# EAGLE design GBCZ (EAGLE 8.6.3)

## Sheet 1 of 2: Button PCB and Audio
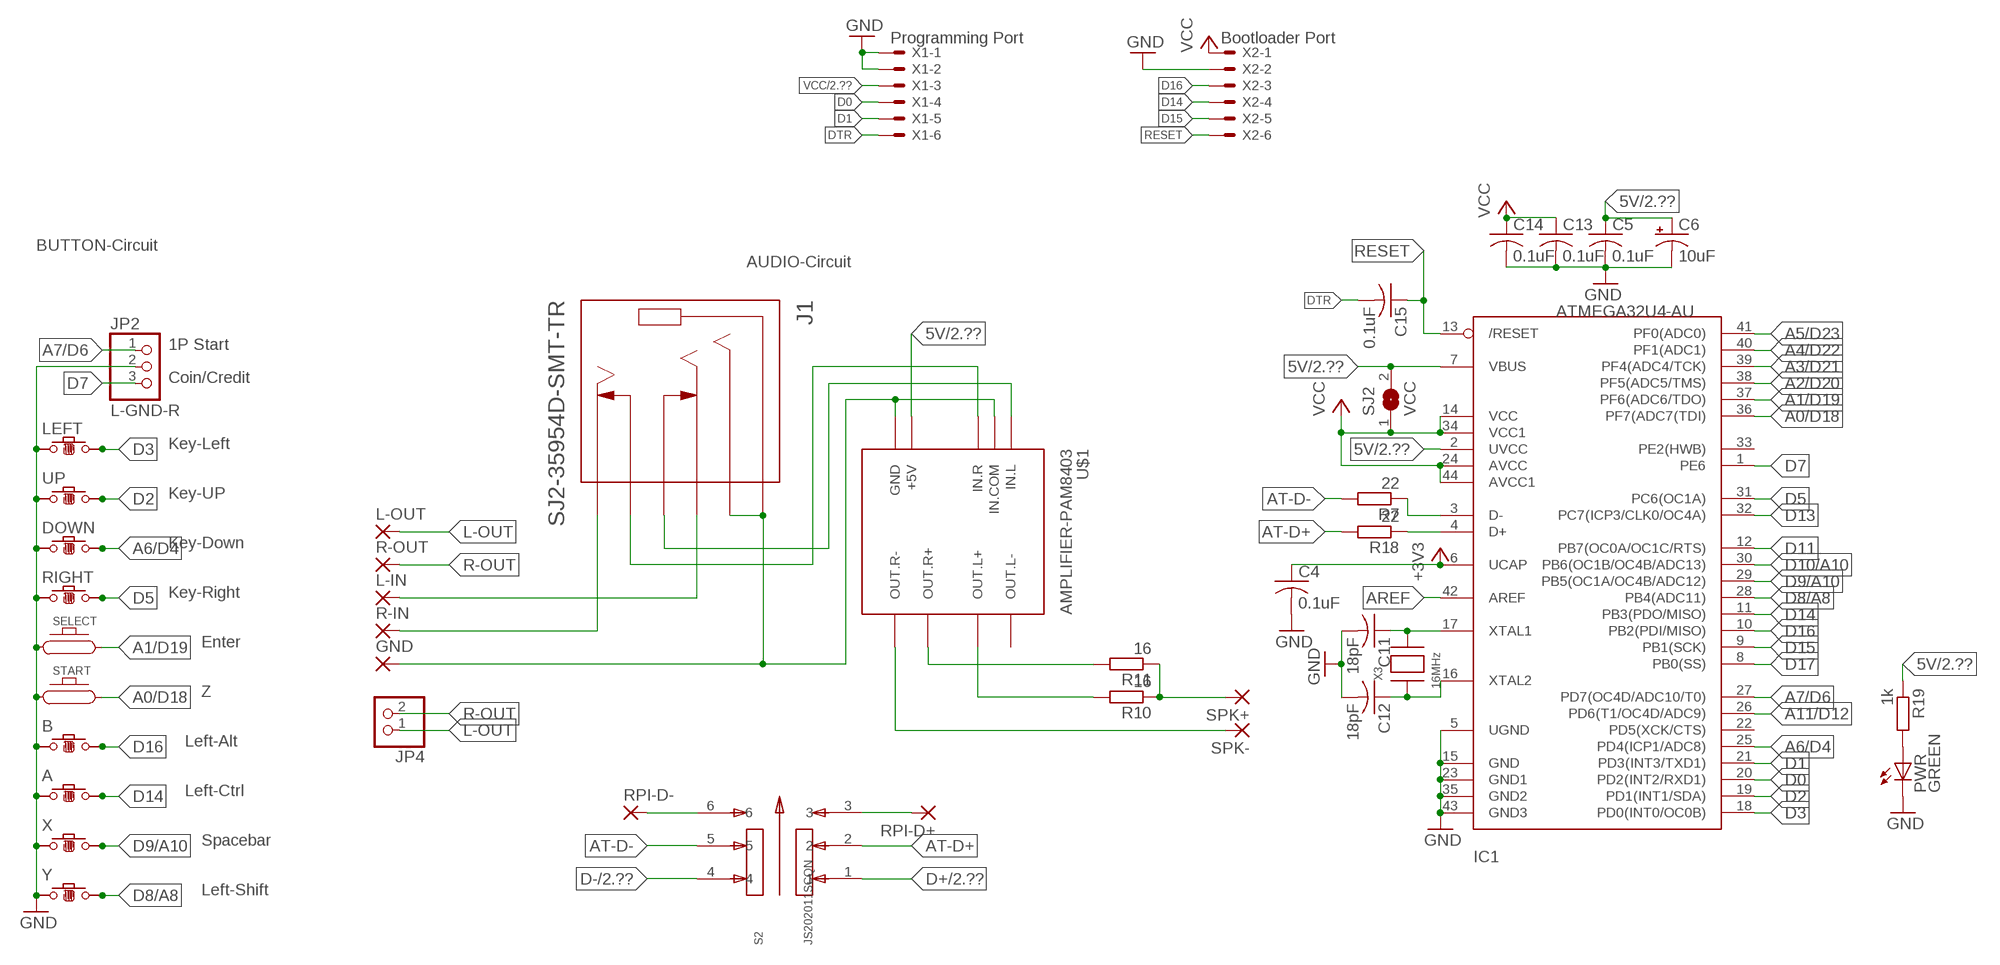
[diagram p0: schematic, sheet 1]

### Parts
A  GBC_BTN  [GBC_BTN]
B  GBC_BTN  [GBC_BTN]
C4  0.1uF  C-USC0805K  [C0805K]
C5  0.1uF  C-USC0805K  [C0805K]
C6  10uF  CPOL-USA/3216-18R  [A/3216-18R]
C11  18pF  C-USC0805K  [C0805K]
C12  18pF  C-USC0805K  [C0805K]
C13  0.1uF  C-USC0805K  [C0805K]
C14  0.1uF  C-USC0805K  [C0805K]
C15  0.1uF  C-USC0805K  [C0805K]
DOWN  GBC_BTN  [GBC_BTN]
GND  WIREPADSMD1,27-254  [SMD1,27-2,54]
IC1  ATMEGA32U4-AU  [TQFP44]
J1  SJ2-35954D-SMT-TR  [CUI_SJ2-35954D-SMT-TR]
JP2  L-GND-R  PINHD-1X3  [1X03]
JP4  PINHD-1X2  [1X02]
L-IN  WIREPADSMD1,27-254  [SMD1,27-2,54]
L-OUT  WIREPADSMD1,27-254  [SMD1,27-2,54]
LEFT  GBC_BTN  [GBC_BTN]
PWR  GREEN  LEDCHIPLED_0805  [CHIPLED_0805]
R7  22  R-EU_R0603  [R0603]
R10  16  R-EU_R0603  [R0603]
R11  16  R-EU_R0603  [R0603]
R18  22  R-EU_R0603  [R0603]
R19  1k  R-EU_R0603  [R0603]
R-IN  WIREPADSMD1,27-254  [SMD1,27-2,54]
R-OUT  WIREPADSMD1,27-254  [SMD1,27-2,54]
RIGHT  GBC_BTN  [GBC_BTN]
RPI-D+  WIREPADSMD1,27-254  [SMD1,27-2,54]
RPI-D-  WIREPADSMD1,27-254  [SMD1,27-2,54]
S2  JS202011SCQN  [SW_JS202011SCQN]
SELECT  GBC_BTN_START  [GBC_BTN_START]
SJ2  VCC  SJ  [SJ]
SPK+  WIREPADSMD1,27-254  [SMD1,27-2,54]
SPK-  WIREPADSMD1,27-254  [SMD1,27-2,54]
START  GBC_BTN_START  [GBC_BTN_START]
U$1  AMPLIFIER-PAM8403  [AMPLIFIER-PAM8403]
UP  GBC_BTN  [GBC_BTN]
X  GBC_BTN  [GBC_BTN]
X1  Programming Port  22-23-2061  [22-23-2061]
X2  Bootloader Port  22-23-2061  [22-23-2061]
X3  16MHz  XTALNX5032  [NX5032]
Y  GBC_BTN  [GBC_BTN]

### Nets
5V: C5.1 C6.+ IC1.2(UVCC) IC1.7(VBUS) R19.1 SJ2.2 U$1.+5V ; also sheet 2
+3V3: C4.1 IC1.6(UCAP)
A0/D18: IC1.36(PF7(ADC7(TDI)) START.P$2
A1/D19: IC1.37(PF6(ADC6/TDO)) SELECT.P$2
A2/D20: IC1.38(PF5(ADC5/TMS))
A3/D21: IC1.39(PF4(ADC4/TCK))
A4/D22: IC1.40(PF1(ADC1))
A5/D23: IC1.41(PF0(ADC0))
A6/D4: DOWN.P$2 IC1.25(PD4(ICP1/ADC8))
A7/D6: IC1.27(PD7(OC4D/ADC10/T0)) JP2.1
A11/D12: IC1.26(PD6(T1/OC4D/ADC9))
AREF: IC1.42(AREF)
AT-D+: R18.2 S2.2
AT-D-: R7.2 S2.5
D0: IC1.20(PD2(INT2/RXD1)) X1.4
D1: IC1.21(PD3(INT3/TXD1)) X1.5
D2: IC1.19(PD1(INT1/SDA)) UP.P$2
D3: IC1.18(PD0(INT0/OC0B)) LEFT.P$2
D5: IC1.31(PC6(OC1A)) RIGHT.P$2
D7: IC1.1(PE6) JP2.3
D8/A8: IC1.28(PB4(ADC11)) Y.P$2
D9/A10: IC1.29(PB5(OC1A/OC4B/ADC12)) X.P$2
D10/A10: IC1.30(PB6(OC1B/OC4B/ADC13))
D11: IC1.12(PB7(OC0A/OC1C/RTS))
D13: IC1.32(PC7(ICP3/CLK0/OC4A))
D14: A.P$2 IC1.11(PB3(PDO/MISO)) X2.4
D15: IC1.9(PB1(SCK)) X2.5
D16: B.P$2 IC1.10(PB2(PDI/MISO)) X2.3
D17: IC1.8(PB0(SS))
D+: S2.1 ; also sheet 2
D-: S2.4 ; also sheet 2
DTR: C15.2 X1.6
GND: A.P$1 B.P$1 C4.2 C5.2 C6.- C11.2 C12.2 C13.2 C14.2 DOWN.P$1 IC1.5(UGND) IC1.15(GND) IC1.23(GND1) IC1.35(GND2) IC1.43(GND3) JP2.2 LEFT.P$1 PWR.C RIGHT.P$1 SELECT.P$1 START.P$1 UP.P$1 X1.1 X1.2 X2.2 X.P$1 Y.P$1 ; also sheet 2
L-OUT: JP4.1 L-OUT.1(P)
N$1: RPI-D-.1(P) S2.6
N$2: RPI-D+.1(P) S2.3
N$21: R11.2 U$1.OUT.R+
N$22: GND.1(P) J1.1(SLEEVE) J1.4(RING2) U$1.GND U$1.IN.COM
N$23: J1.11(RING1_SWITCH) U$1.IN.L
N$24: J1.10(TIP_SWITCH) U$1.IN.R
N$25: J1.2(TIP) R-IN.1(P)
N$26: J1.3(RING1) L-IN.1(P)
N$27: R10.2 U$1.OUT.L+
N$28: R10.1 R11.1 SPK+.1(P)
N$29: SPK-.1(P) U$1.OUT.R-
N$41: IC1.3(D-) R7.1
N$42: IC1.4(D+) R18.1
N$43: C12.1 IC1.16(XTAL2) X3.P$1
N$44: C11.1 IC1.17(XTAL1) X3.P$2
N$45: PWR.A R19.2
R-OUT: JP4.2 R-OUT.1(P)
RESET: C15.1 IC1.13(/RESET) X2.6
VCC: C13.1 C14.1 IC1.14(VCC) IC1.24(AVCC) IC1.34(VCC1) IC1.44(AVCC1) SJ2.1 X1.3 ; also sheet 2
Unconnected: IC1.22(PD5(XCK/CTS)) IC1.33(PE2(HWB)) U$1.OUT.L- X2.1

### Notes on the sheet
- BUTTON-Circuit
- AUDIO-Circuit
- 1P Start
- Coin/Credit
- Key-Left
- Key-UP
- Key-Down
- Key-Right
- Enter
- Z
- Left-Alt
- Left-Ctrl
- Spacebar
- Left-Shift

## Sheet 2 of 2: Batterie Charging/Boosting/Protection
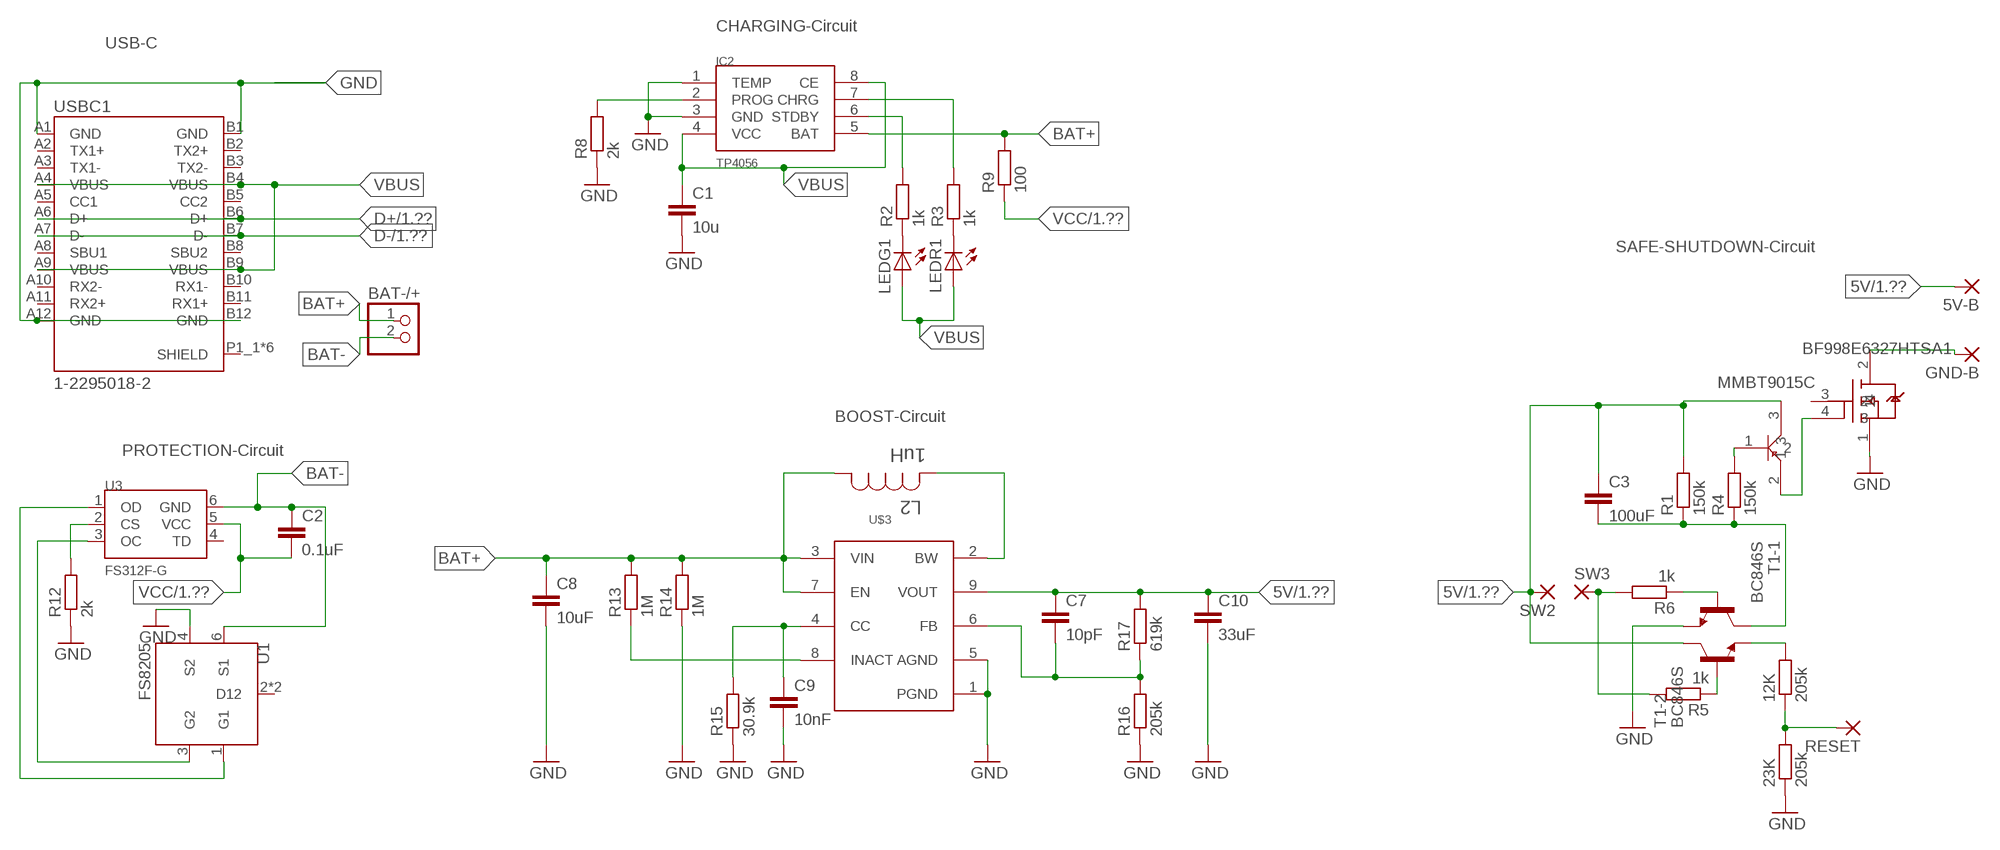
[diagram p1: schematic, sheet 2]

### Parts
5V-B  WIREPADSMD1,27-254  [SMD1,27-2,54]
12K  205k  R-EU_R0603  [R0603]
23K  205k  R-EU_R0603  [R0603]
BAT-/+  PINHD-1X2  [1X02]
BF998E6327HTSA1  INF-SOT143-4-1_V_1  [INF-SOT143-4-1_V_1PRIMARY]
C1  10u  C-EUC0603  [C0603]
C2  0.1uF  C-EUC0603  [C0603]
C3  100uF  C-EUC1812  [C1812]
C7  10pF  C-EUC1812  [C1812]
C8  10uF  C-EUC1812  [C1812]
C9  10nF  C-EUC1812  [C1812]
C10  33uF  C-EUC1812  [C1812]
GND-B  WIREPADSMD1,27-254  [SMD1,27-2,54]
IC2  TP4056  [SOP-8]
L2  1uH  DR74-220-R  [INDM7676X435N]
LEDG1  LEDCHIP-LED0603  [CHIP-LED0603]
LEDR1  LEDCHIP-LED0603  [CHIP-LED0603]
MMBT9015C  INF-SOT23_M_1  [INF-SOT23_M_1PRIMARY]
R1  150k  R-EU_R0603  [R0603]
R2  1k  R-EU_R0603  [R0603]
R3  1k  R-EU_R0603  [R0603]
R4  150k  R-EU_R0603  [R0603]
R5  1k  R-EU_R0603  [R0603]
R6  1k  R-EU_R0603  [R0603]
R8  2k  R-EU_R0603  [R0603]
R9  100  R-EU_R0603  [R0603]
R12  2k  R-EU_R0603  [R0603]
R13  1M  R-EU_R0603  [R0603]
R14  1M  R-EU_R0603  [R0603]
R15  30.9k  R-EU_R0603  [R0603]
R16  205k  R-EU_R0603  [R0603]
R17  619k  R-EU_R0603  [R0603]
RESET  WIREPADSMD1,27-254  [SMD1,27-2,54]
SW2  WIREPADSMD1,27-254  [SMD1,27-2,54]
SW3  WIREPADSMD1,27-254  [SMD1,27-2,54]
T1  BC846S  [SOT363]
U1  FS8205  [SOT23-6]
U3  FS312F-G  [SOT23-6]
U$3  TPS61235RWLR  CONV_TPS61235RWLR  [CONV_TPS61235RWLR]
USBC1  1-2295018-2  [TE_1-2295018-2]

### Nets
5V: 5V-B.1(P) C3.1 C7.1 C10.1 MMBT9015C.3 R1.2 R17.2 SW2.1(P) T1.3(-2:C) U$3.9(VOUT) ; also sheet 1
BAT+: BAT-/+.1 C8.1 IC2.5(BAT) L2.1 R9.2 R13.2 R14.2 U$3.3(VIN) U$3.7(EN)
BAT-: BAT-/+.2 C2.1 U1.6(S1) U3.6(GND)
D+: USBC1.A6(D+) USBC1.B6(D+) ; also sheet 1
D-: USBC1.A7(D-) USBC1.B7(D-) ; also sheet 1
GND: 23K.1 BF998E6327HTSA1.1 C1.2 C8.2 C9.2 C10.2 IC2.1(TEMP) IC2.3(GND) R8.1 R12.1 R14.1 R15.1 R16.1 T1.1(-1:E) U1.4(S2) U$3.1(PGND) U$3.5(AGND) USBC1.A1(GND) USBC1.A12(GND) USBC1.B1(GND) USBC1.B12(GND) ; also sheet 1
N$11: BF998E6327HTSA1.2 GND-B.1(P)
N$12: BF998E6327HTSA1.4 MMBT9015C.2
N$13: MMBT9015C.1 R4.2
N$14: 12K.2 T1.4(-2:E)
N$15: C3.2 R1.1 R4.1 T1.6(-1:C)
N$16: R6.1 T1.2(-1:B)
N$17: R5.2 R6.2 SW3.1(P)
N$18: R5.1 T1.5(-2:B)
N$19: R13.1 U$3.8(INACT)
N$20: C9.1 R15.2 U$3.4(CC)
N$30: IC2.6(STDBY) R2.2
N$31: IC2.7(CHRG) R3.2
N$32: LEDG1.C R2.1
N$33: L2.2 U$3.2(BW)
N$34: LEDR1.C R3.1
N$35: C7.2 R16.2 R17.1 U$3.6(FB)
N$36: IC2.2(PROG) R8.2
N$37: U1.3(G2) U3.3(OC)
N$38: U1.1(G1) U3.1(OD)
N$39: R12.2 U3.2(CS)
N$40: 12K.1 23K.2 RESET.1(P)
VBUS: C1.1 IC2.4(VCC) IC2.8(CE) LEDG1.A LEDR1.A USBC1.A4(VBUS) USBC1.A9(VBUS) USBC1.B4(VBUS) USBC1.B9(VBUS)
VCC: C2.2 R9.1 U3.5(VCC) ; also sheet 1
Unconnected: BF998E6327HTSA1.3 U1.2(D12) U1.5(D12) U3.4(TD) USBC1.A2(TX1+) USBC1.A3(TX1-) USBC1.A5(CC1) USBC1.A8(SBU1) USBC1.A10(RX2-) USBC1.A11(RX2+) USBC1.B2(TX2+) USBC1.B3(TX2-) USBC1.B5(CC2) USBC1.B8(SBU2) USBC1.B10(RX1-) USBC1.B11(RX1+) USBC1.P1_1(SHIELD) USBC1.P1_2(SHIELD) USBC1.P2_1(SHIELD) USBC1.P2_2(SHIELD) USBC1.P4(SHIELD) USBC1.P5(SHIELD)

### Notes on the sheet
- CHARGING-Circuit
- USB-C
- SAFE-SHUTDOWN-Circuit
- BOOST-Circuit
- PROTECTION-Circuit

## Library data of the parts
5V-B GND GND-B L-IN L-OUT R-IN R-OUT RESET RPI-D+ RPI-D- SPK+ SPK- SW2 SW3 = wirepad:WIREPAD: Wire PAD connect wire on PCB
12K 23K R1-R19 = rcl:R-EU_: RESISTOR, European symbol; SPICEPREFIX: R
A B DOWN LEFT RIGHT UP X Y = GB Color:GBC_BTN
BAT-/+ JP4 = pinhead:PINHD-1X2: PIN HEADER
BF998E6327HTSA1 = INF-SOT143-4-1_V:INF-SOT143-4-1_V_1
C1-C3 C7-C10 = rcl:C-EU: CAPACITOR, European symbol; SPICEPREFIX: C
C4 C5 C11-C15 = adafruit:C-US: CAPACITOR, American symbol
C6 = adafruit:CPOL-US: POLARIZED CAPACITOR, American symbol
IC1 = adaprog:ATMEGA32U4
IC2 = TP4056:TP4056
J1 = SJ2-35954D-SMT-TR:SJ2-35954D-SMT-TR: 4 conductors, 3.5mm, SMT Audio Jack w/ 2 Switch; AVAILABILITY: Good; DESCRIPTION: 4 conductors, 3.5mm, SMT Audio Jack w/ 2 Switch; MF: CUI; MP: SJ2-35954D-SMT-TR; PACKAGE: None; PRICE: 0.94 USD
JP2 = pinhead:PINHD-1X3: PIN HEADER
L2 = DR74-220-R:DR74-220-R: POWER INDUCTOR; AVAILABILITY: Good; DESCRIPTION: Inductor Power Shielded Drum Core 21.73uH/22uH 20% 100KHz Ferrite 1.75A 92.5mOhm DCR T/R; MF: Eaton; MP: DR74-220-R; PACKAGE: Nonstandard Eaton; PRICE: 0.98 USD
LEDG1 LEDR1 = led:LED: LED
MMBT9015C = INF-SOT23_M:INF-SOT23_M_1
PWR = adafruit:LED: LED
S2 = JS202011SCQN:JS202011SCQN: JS Series DPDT On-On Gull Wing Surface Mount Subminiature Slide Switch; AVAILABILITY: Unavailable; DESCRIPTION: JS Series DPDT On-On Gull Wing Surface Mount Subminiature Slide Switch; MF: C&K Components; MP: JS202011SCQN; PACKAGE: None; PRICE: None
SELECT START = GB Color:GBC_BTN_START: START and SELECT button for the Game Boy Color
SJ2 = jumper:SJ: SMD solder JUMPER
T1 = nxp_60:BC846S: Dual 65 V, 100 mA NPN/NPN general-purpose transistor AAL Eindhoven MK
U1 = fs8205:FS8205
U3 = fs321f-g:FS312F-G
U$1 = diy-modules:AMPLIFIER-PAM8403: Stereo Class-D 3W Audio Amplifier based on PAM8403 chip More details available here: http://artofcircuits.com/product/pam8403-5v-two-channel-stereo-mini-class-d-3w3w-audio-amplifier Click here to find device on ebay.com <http://www.ebay.com/sch/pam8403+mini+class+d>
U$3 = CONV_TPS61235RWLR:CONV_TPS61235RWLR
USBC1 = 1-2295018-2:1-2295018-2: SPLASH PROOF USB TYPE C REC, DUAL SMT; Tape/Reel of 900; AVAILABILITY: Good; CENTERLINE_PITCH: .5 mm[.019 in]; COMMENT: 1-2295018-2; DESCRIPTION: USB TYPE C, REC OFFSET 0.65MM DUAL SMT; MF: TE Connectivity; MP: 1-2295018-2; NUMBER_OF_POSITIONS: 24; PACKAGE: None; PRICE: 1.82 USD; PRODUCT_TYPE: Connector
X1 X2 = con-molex:22-23-2061: .100" (2.54mm) Center Header - 6 Pin; MF: MOLEX; MPN: 22-23-2061; OC_FARNELL: 1462922; OC_NEWARK: 27C1933
X3 = adaprog:XTAL

## Board
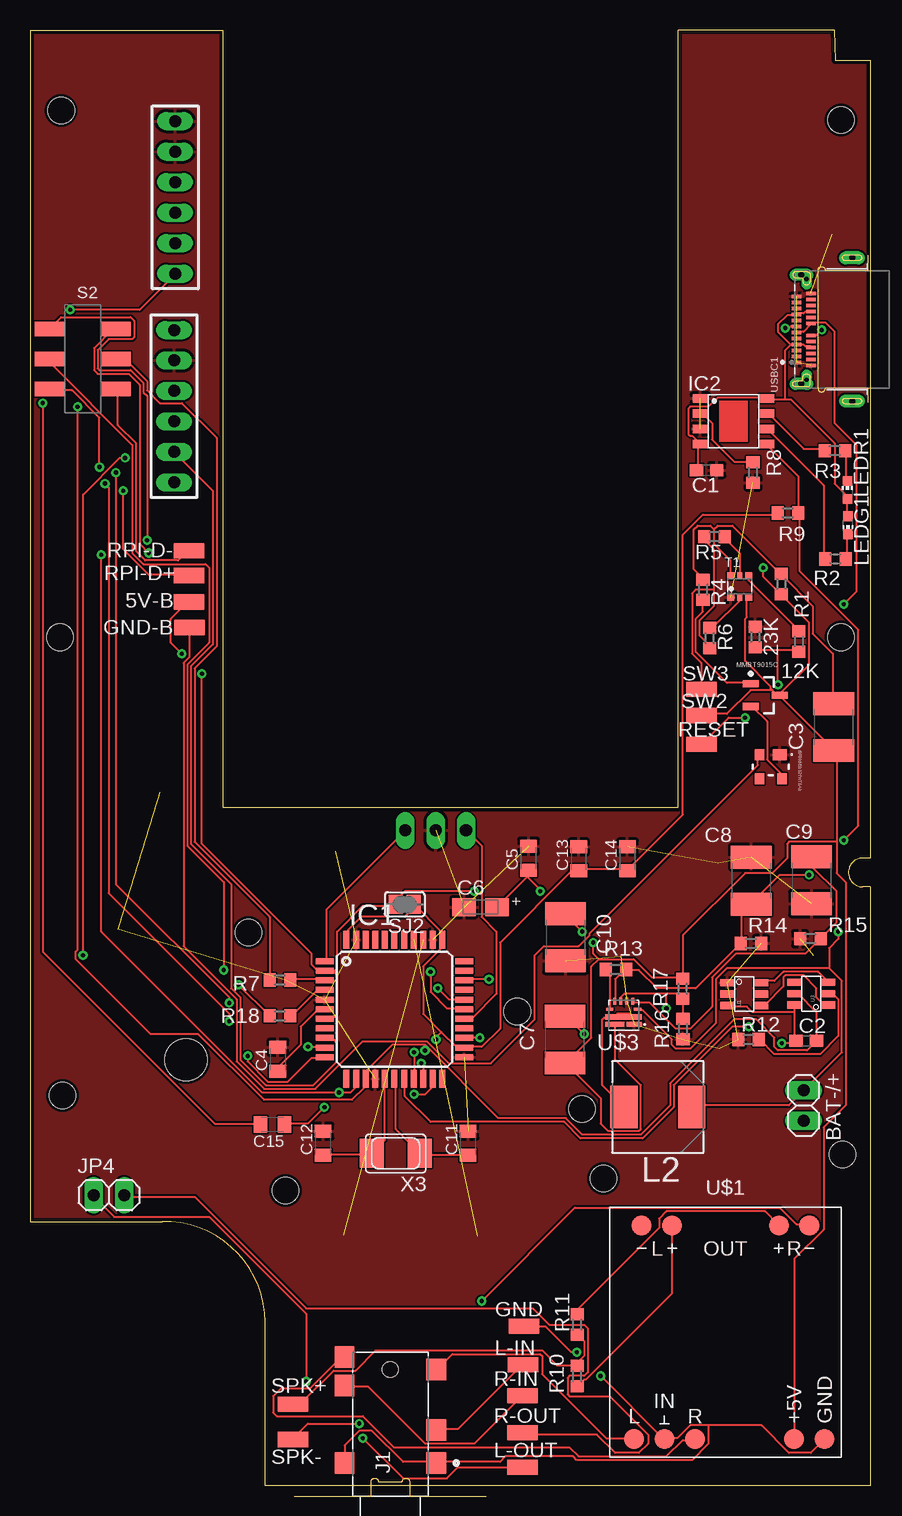
[diagram p2: board, top side]
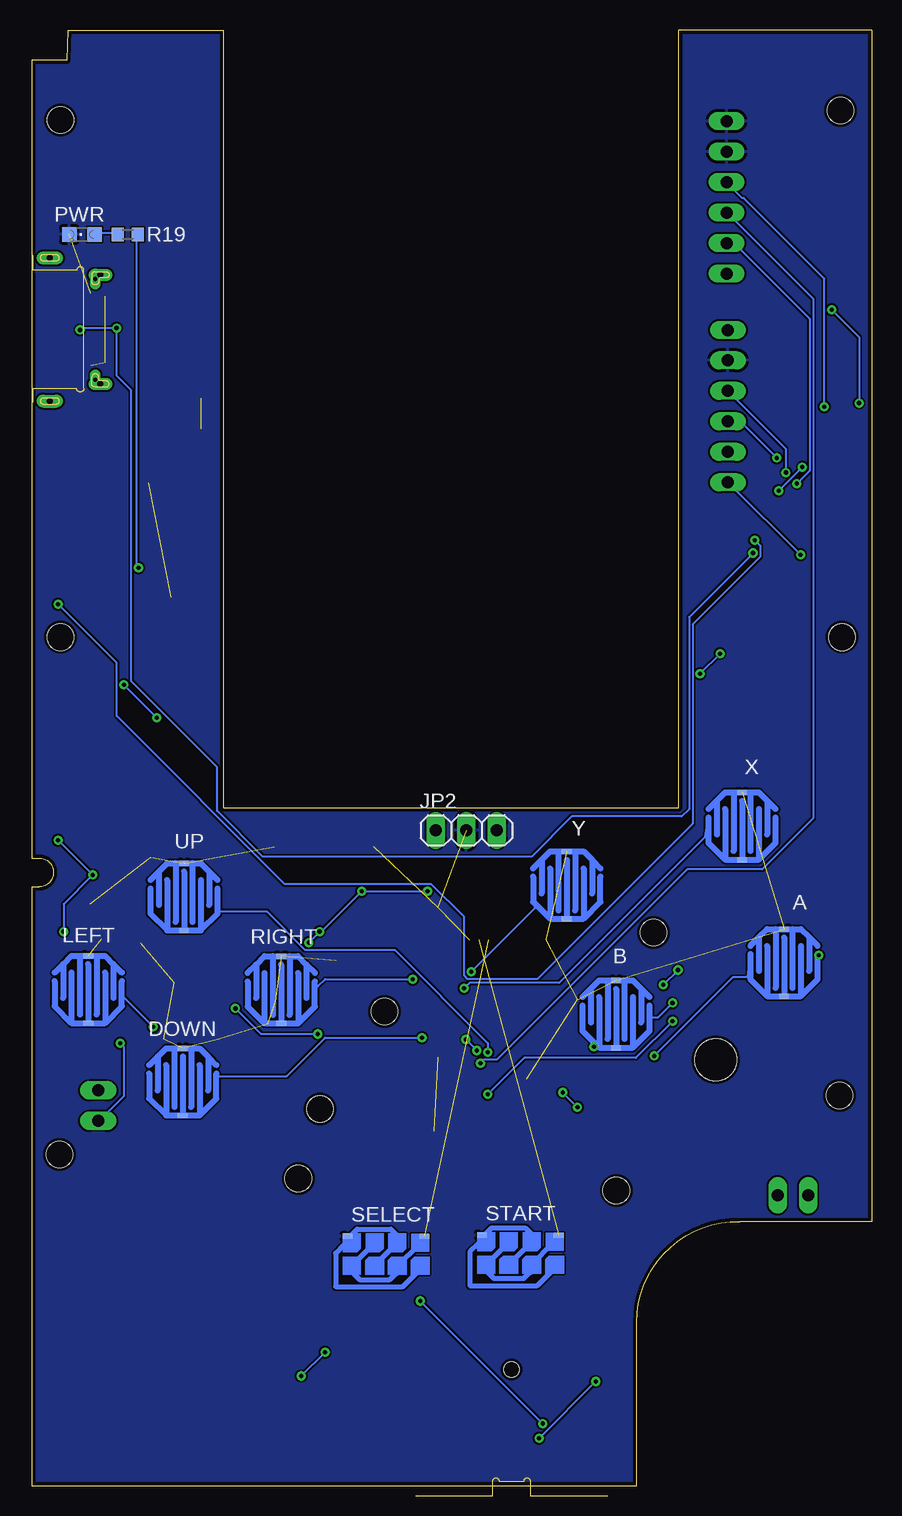
[diagram p3: board, bottom side, seen from below]

Size 70 x 121.3 mm. Coordinates in mm from the lower left corner, seen from the top.
Outline: 70,0 19.6,0 19.6,13.6 arc91 11,22 0,22 0,121.3 16.1,121.3 16.1,56.5 54,56.5 54,121.3 67,121.3 67.1,118.8 70,118.8 70,52.3 69.4,52.3 arc180 69.4,49.9 70,49.9 70,0
Copper layers (1*16): Top 0.035mm / dielectric 1.5mm / Bottom 0.035mm
Design rules "default *": minimum track width 6mil, minimum drill 0.35mm, track to track 6mil, track to pad 6mil, pad to pad 6mil, via to via 6mil, smd to smd 6mil, copper to edge 10mil, drill to drill 6mil, minimum pad ring 10mil, minimum via ring 8mil, stop-mask expansion 4mil, vias tented up to drill 0mil, thermal gap 10mil
Holes 2.2 mm at 2.6,114.6 67.6,113.8 2.5,70.7 67.6,70.7 18.2,46.1 2.7,32.5 40.6,39.5 46,31.4 21.3,24.6 47.8,25.6 67.7,27.6
Holes 3.5 mm at 13,35.5

### Footprints (pad centres in the part's own frame; a part is rotated, then mirrored left to right if it is on the bottom)
SMD1,27-2,54 = smd 1.27 x 2.54: 1 0,0
R0603 = smd 1 x 1.1: 1 -0.85,0; 2 0.85,0
GBC_BTN = smd 0.813 x 0.406: P$1 -0.01,2.79; P$2 -0.01,-2.81
1X02 = drill 1.016 long: 1 -1.27,0; 2 1.27,0
INF-SOT143-4-1_V_1PRIMARY = smd 0.9 x 1.2: 1 -1,0.75 | smd 0.9 x 0.8: 2 -1,-0.95; 3 1,-0.95; 4 1,0.95
C0603 = smd 1.1 x 1: 1 -0.85,0; 2 0.85,0
C1812 = smd 1.9 x 3.4: 1 -1.95,0; 2 1.95,0
C0805K = smd 1.1 x 1.4: 1 -1,0; 2 1,0
A/3216-18R = smd 1.95 x 1.5: + 1.375,0; - -1.375,0
TQFP44 = smd 1.5 x 0.5: 1 -5.8,4; 2 -5.8,3.2; 3 -5.8,2.4; 4 -5.8,1.6; 5 -5.8,0.8; 6 -5.8,0; 7 -5.8,-0.8; 8 -5.8,-1.6; 9 -5.8,-2.4; 10 -5.8,-3.2; 11 -5.8,-4; 23 5.8,-4; 24 5.8,-3.2; 25 5.8,-2.4; 26 5.8,-1.6; 27 5.8,-0.8; 28 5.8,0; 29 5.8,0.8; 30 5.8,1.6; 31 5.8,2.4; 32 5.8,3.2; 33 5.8,4 | smd 0.5 x 1.5: 12 -4,-5.8; 13 -3.2,-5.8; 14 -2.4,-5.8; 15 -1.6,-5.8; 16 -0.8,-5.8; 17 0,-5.8; 18 0.8,-5.8; 19 1.6,-5.8; 20 2.4,-5.8; 21 3.2,-5.8; 22 4,-5.8; 34 4,5.8; 35 3.2,5.8; 36 2.4,5.8; 37 1.6,5.8; 38 0.8,5.8; 39 0,5.8; 40 -0.8,5.8; 41 -1.6,5.8; 42 -2.4,5.8; 43 -3.2,5.8; 44 -4,5.8
SOP-8 = smd 1.3 x 0.7: 1 -2.75,1.905; 2 -2.75,0.635; 3 -2.75,-0.635; 4 -2.75,-1.905; 5 2.75,-1.905; 6 2.75,-0.635; 7 2.75,0.635; 8 2.75,1.905
CUI_SJ2-35954D-SMT-TR = smd 1.8 x 1.65: 1 -3.25,-3.825; 2 3.2,3.825; 3 -0.5,-3.825; 4 -3.25,3.825; 10 5.6,3.825; 11 4.55,-3.825 | hole 1.3: 4.55,0
1X03 = drill 1.016 long: 1 -2.54,0; 2 0,0; 3 2.54,0
INDM7676X435N = smd 2.261 x 3.505: 1 -2.819,0; 2 2.819,0
CHIP-LED0603 = smd 0.8 x 0.8: A 0,-0.75; C 0,0.75
INF-SOT23_M_1PRIMARY = smd 1.35 x 0.6: 1 -1.2,0.95; 2 -1.2,-0.95; 3 1.2,0
CHIPLED_0805 = smd 1.2 x 1.2: A 0,-1.05; C 0,1.05
SW_JS202011SCQN = smd 1.2 x 2.5: 1 -2.5,-2.75; 2 0,-2.75; 3 2.5,-2.75; 4 -2.5,2.75; 5 0,2.75; 6 2.5,2.75
GBC_BTN_START = smd 0.813 x 0.406: P$1 -3.3,1.4; P$2 3.1,1.4
SJ = smd 1.168 x 1.6: 1 -0.762,0; 2 0.762,0
SOT363 = smd 0.6 x 0.6: 1 -0.75,-0.9; 3 0.75,-0.9; 4 0.75,0.9; 6 -0.75,0.9 | smd 0.4 x 0.6: 2 0,-0.9; 5 0,0.9
SOT23-6 = smd 0.6 x 1.2: 1 -0.95,-1.4; 2 0,-1.4; 3 0.95,-1.4; 4 0.95,1.4; 5 0,1.4; 6 -0.95,1.4
AMPLIFIER-PAM8403 = smd 1.676 x 1.676: +5V 5.715,-8.89; GND 8.255,-8.89; IN.COM -5.08,-8.89; IN.L -7.62,-8.89; IN.R -2.54,-8.89; OUT.L+ -4.445,8.89; OUT.L- -6.985,8.89; OUT.R+ 4.445,8.89; OUT.R- 6.985,8.89
CONV_TPS61235RWLR = smd 1.24 x 0.44: 1 -0.9,0.77 | smd 3.04 x 0.44: 2 0,0.17 | smd 0.6 x 0.25: 3 -1.15,-0.475; 8 1.15,-0.475 | smd 0.25 x 0.6: 4 -0.75,-1.15; 5 -0.25,-1.15; 6 0.25,-1.15; 7 0.75,-1.15 | smd 1.59 x 0.44: 9 0.725,0.77
TE_1-2295018-2 = smd 0.3 x 0.8: A1 -2.75,4.63; A2 -2.25,4.63; A3 -1.75,4.63; A4 -1.25,4.63; A5 -0.75,4.63; A6 -0.25,4.63; A7 0.25,4.63; A8 0.75,4.63; A9 1.25,4.63; A10 1.75,4.63; A11 2.25,4.63; A12 2.75,4.63; B1 3,3.43; B2 2.5,3.43; B3 2,3.43; B4 1.5,3.43; B5 1,3.43; B6 0.5,3.43; B7 -0.5,3.43; B8 -1,3.43; B9 -1.5,3.43; B10 -2,3.43; B11 -2.5,3.43; B12 -3,3.43 | drill 0.5 long: P1_1 -4.55,4.22; P2_1 4.55,4.22 | drill 0.35 long: P1_2 -4.191,3.795; P2_2 4.191,3.795 | drill 0.5 pad 1.1 long: P4 -5.97,0; P5 5.97,0
22-23-2061 = drill 1 long: 1 -6.35,0; 2 -3.81,0; 3 -1.27,0; 4 1.27,0; 5 3.81,0; 6 6.35,0
NX5032 = smd 2 x 2.4: P$1 2,0; P$2 -2,0

### Placement (x,y rotation side)
5V-B  13.24,73.64 270 top
12K  64.07,70.34 90 top
23K  60.45,70.72 270 top
A  7.31,43.59 0 bottom
B  21.31,39.31 0 bottom
BAT-/+  64.47,31.67 270 top
BF998E6327HTSA1  61.73,59.91 270 top
C1  56.38,84.63 0 top
C2  64.69,37.07 0 top
C3  66.99,63.21 90 top
C4  20.66,35.53 90 top
C5  41.54,52.27 90 top
C6  37.54,48.22 0 top
C7  44.58,37.17 90 top
C8  60.11,50.41 90 top
C9  65.13,50.45 270 top
C10  44.63,45.7 270 top
C11  36.5,28.53 90 top
C12  24.42,28.53 90 top
C13  45.73,52.23 90 top
C14  49.78,52.23 90 top
C15  20.2,30.1 180 top
DOWN  57.41,33.65 0 bottom
GND  41.15,13.28 270 top
GND-B  13.3,71.51 270 top
IC1  30.37,39.7 0 top
IC2  58.62,88.69 0 top
J1  30.03,5.13 90 top
JP2  33.8,54.6 0 bottom
JP4  6.58,24.2 0 top
L2  52.32,31.55 180 top
L-IN  41.09,10.07 270 top
L-OUT  41.03,1.54 270 top
LEDG1  68.16,80.03 180 top
LEDR1  68.11,82.97 0 top
LEFT  65.29,41.36 0 bottom
MMBT9015C  61.27,65.87 0 top
PWR  65.82,104.26 90 bottom
R1  62.61,75.14 270 top
R2  67.11,77.22 180 top
R3  67.08,86.25 180 top
R4  56.09,74.65 270 top
R5  57.04,79.08 180 top
R6  56.64,70.62 270 top
R7  20.82,42.13 180 top
R8  60.24,84.42 90 top
R9  63.16,81.05 0 top
R10  45.6,9.12 270 top
R11  45.6,13.42 90 top
R12  59.87,37.18 0 top
R13  48.82,43.01 0 top
R14  60.07,45.18 180 top
R15  65.03,45.58 0 top
R16  54.41,38.05 90 top
R17  54.39,41.41 90 top
R18  20.82,39.15 180 top
R19  62.01,104.26 180 bottom
R-IN  41.03,7.49 270 top
R-OUT  41.03,4.41 270 top
RESET  55.97,61.79 270 top
RIGHT  49.21,41.33 0 bottom
RPI-D+  13.24,75.84 270 top
RPI-D-  13.24,77.91 90 top
S2  4.41,93.89 270 top
SELECT  40.39,19.37 0 bottom
SJ2  31.23,48.44 180 top
SPK+  21.92,6.78 90 top
SPK-  21.92,3.85 90 top
START  29.19,19.47 0 bottom
SW2  55.97,64.17 270 top
SW3  55.97,66.36 270 top
T1  59.14,74.93 0 top
U1  59.52,40.97 90 top
U3  65.09,41 90 top
U$1  57.95,12.79 0 top
U$3  49.47,39.21 180 top
UP  57.31,49.07 0 bottom
USBC1  68.51,96.35 90 top
X  10.81,54.97 0 bottom
X1  12.1,107.35 270 top
X2  12,89.95 270 top
X3  30.47,27.68 180 top
Y  25.41,50.05 0 bottom

### Tracks (layer width: path | path; a pad name or v marks a point on that pad's centre or on a via)
5V  (via drill 0.35)
  Top 0.152: 25.3,42.81 25.6,42.51 25.6,39.31 25.3,39 24.69,39 IC1.7 | 25.3,42.81 24.69,42.81 IC1.2 | 25.3,42.81 25.6,43.12 25.6,46.17 27.74,48.3 30.33,48.3 SJ2.2 30.48,48.45 30.48,48.76 31.24,49.52 v37.03,49.52 | 25.3,42.81 IC1.2 | v12.65,69.33 11.73,70.25 11.73,72.23 13.11,73.6 5V-B.1 | v14.33,67.66 14.33,53.48 23.47,44.34 23.47,43.42 23.93,42.97 24.54,42.97 IC1.2 | 61.87,66.28 62.33,65.83 MMBT9015C.3 | 61.87,66.28 61.72,66.44 61.72,66.59 59.59,68.72 59.59,72.23 59.74,72.38 59.74,73.9 T1.3 | MMBT9015C.3 62.48,65.98 64.92,68.42 64.92,71.92 62.64,74.21 R1.2 62.48,74.36 61.11,75.73 v61.11,76.49 | 61.87,66.28 60.05,66.28 58.06,64.3 56.08,64.3 SW2.1 | 41.45,50.74 41.45,51.2 C5.1 41.45,50.74 | 41.45,50.74 39.01,48.3 C6.+ | 47.4,43.88 50.29,43.88 51.82,42.36 54.25,42.36 R17.2 54.41,42.36 54.41,45.86 59.59,51.04 61.87,51.04 63.09,52.26 63.09,53.48 63.25,53.63 67.21,53.63 | 47.4,43.88 46.79,43.27 46.79,37.33 44.65,35.19 | 44.65,35.19 47.55,32.3 47.55,30.16 48.16,29.55 50.75,29.55 50.9,29.71 50.9,33.36 48.77,35.5 48.77,38.39 U$3.9 | 44.65,35.19 C7.1 | v46.02,46.17 44.65,47.54 C10.1 | v46.94,45.25 46.94,44.34 47.4,43.88 | 41.45,50.74 42.52,49.67 v42.52,49.52 | 67.21,53.63 67.21,61.1 67.06,61.25 C3.1 66.9,61.41 62.48,65.83 MMBT9015C.3 | 67.21,53.63 67.21,51.04 67.97,50.28 67.97,31.69 66.14,29.86 66.14,21.33 63.7,18.89 63.7,3.95 U$1.+5V
  Bottom 0.152: v14.33,67.66 v12.65,69.33 | v61.11,76.49 61.27,76.65 61.27,104.23 R19.1 | v46.94,45.25 v46.02,46.17 45.87,46.17 v42.52,49.52 v37.03,49.52
+3V3
  Top 0.152: C4.1 20.73,34.58 20.73,34.89 22.55,36.72 22.55,38.24 23.93,39.61 24.54,39.61 IC1.6
A0/D18  (1 unrouted)
A1/D19  (1 unrouted)
A6/D4  (via drill 0.35)
  Top 0.152: v37.49,37.33 36.27,37.33 IC1.25
  Bottom 0.152: v37.49,37.33 45.57,37.33 48.77,34.13 54.41,34.13 54.62,34.34
A7/D6
  Top 0.152: IC1.27 36.27,39 36.88,39 38.86,40.98 38.86,46.17 37.64,47.39 37.64,53.33 36.42,54.55 JP2.1
AT-D+  (via drill 0.35)
  Top 0.152: v17.37,41.75 R18.2 | v16.15,42.97 16.15,50.28 13.11,53.33 13.11,68.42 14.94,70.25 14.94,76.49 14.63,76.8 9.45,76.8 8.53,77.71 8.53,86.7 1.68,93.56 1.68,93.87 S2.2
  Bottom 0.152: v16.15,42.97 v17.37,41.75
AT-D-
  Top 0.152: R7.2 19.96,42.2 19.96,47.39 13.72,53.63 13.72,68.11 15.54,69.94 15.54,87.31 12.65,90.21 10.82,90.21 9.75,91.28 9.75,92.04 7.92,93.87 7.32,93.87 S2.5
BAT+  (via drill 0.35)
  Top 0.152: 66.6,43.12 58.06,43.12 57.15,42.2 57.15,38.55 55.02,36.41 53.8,36.41 53.49,36.72 53.49,37.17 51.05,39.61 50.75,39.61 U$3.3 | 66.6,43.12 67.67,42.05 67.67,36.11 64.62,33.06 BAT-/+.1 64.47,32.91 63.25,31.69 55.17,31.69 L2.1 | IC2.5 61.42,86.7 64.01,84.11 64.01,81.07 R9.2 64.16,80.91 64.16,76.19 69.04,71.31 69.04,55.01 v67.82,53.79 | U$3.7 48.77,40.38 48.77,42.2 49.53,42.97 R13.2 49.68,42.97 50.75,42.97 52.27,41.44 55.47,41.44 59.13,45.1 R14.2 59.28,45.25 59.28,47.69 60.05,48.45 C8.1 60.2,48.61 62.48,50.89 v64.92,50.89 | 66.6,43.12 66.6,44.8 67.36,45.56 v67.36,46.17
  Bottom 0.152: v67.82,53.79 v64.92,50.89 67.36,48.45 v67.36,46.17
BAT-  (via drill 0.35)
  Top 0.152: 63.7,39.46 63.7,39.92 U3.6 | 63.7,39.46 63.7,37.17 C2.1 63.7,37.02 63.55,36.87 v62.64,36.87 | 63.7,39.46 60.2,39.46 59.74,39.92 58.22,39.92 U1.6
  Bottom 0.152: v62.64,36.87 62.33,36.57 62.33,32.45 63.7,31.08 63.86,31.08 64.47,30.47 BAT-/+.2
D0  (via drill 0.35)
  Top 0.152: v32.61,35.19 32.77,35.04 32.77,33.97 IC1.20
  Bottom 0.152: v32.61,35.19 32.31,35.5 31.24,35.5 15.39,51.35 9.14,51.35 4.88,55.62 4.88,98.9 12.04,106.06 X1.4
D1  (via drill 0.35)
  Top 0.152: v32,32.6 32.92,32.6 33.53,33.21 33.53,33.82 IC1.21 | v16.61,38.7 16.61,39.31 6.55,49.37 6.55,83.2 v6.25,83.5
  Bottom 0.152: v32,32.6 28.96,35.65 19.66,35.65 v16.61,38.7 | v6.25,83.5 5.18,84.57 5.18,97.22 11.43,103.47 12.04,103.47 X1.5
D2  (via drill 0.35)
  Top 0.152: v32,36.11 32,33.97 IC1.19
  Bottom 0.152: v32,36.11 32,36.87 39.78,44.64 47.24,44.64 50.44,47.84 54.41,47.84 54.52,49.76
D3  (via drill 0.35)
  Top 0.152: v59.89,38.24 58.52,38.24 53.65,33.36 53.65,31.54 51.05,28.95 45.87,28.95 44.5,30.32 33.38,30.32 31.24,32.45 31.24,33.82 IC1.18
  Bottom 0.152: v59.89,38.24 62.33,40.68 62.5,42.05
D5  (via drill 0.35)
  Top 0.152: v38.25,42.2 36.27,42.2 IC1.31
  Bottom 0.152: v38.25,42.2 45.57,42.2 46.18,41.59 46.42,42.02
D7
  Top 0.152: IC1.1 24.69,43.73 24.69,48 31.24,54.55 JP2.3
D8/A8  (via drill 0.35)
  Top 0.152: v33.38,42.81 33.38,41.14 34.75,39.77 36.12,39.77 IC1.28
  Bottom 0.152: v33.38,42.81 28.04,48.15 28.22,48.64
D9/A10  (via drill 0.35)
  Top 0.152: v33.98,41.44 34.9,40.53 36.12,40.53 IC1.29
  Bottom 0.152: v33.98,41.44 33.53,41.9 26.06,41.9 13.87,54.09 13.62,55.66
D14  (via drill 0.35)
  Top 0.152: v18.14,35.8 18.14,35.35 19.81,33.67 21.49,33.67 23.47,35.65 24.54,35.65 IC1.11 | v7.92,85.64 7.47,85.64 4.42,82.59 v4.42,44.19
  Bottom 0.152: v18.14,35.8 11.58,42.36 10.36,42.36 10.12,44.28 | v7.92,85.64 10.82,88.53 11.89,88.53 X2.4 | v4.42,44.19 4.52,44.28
D15
  Top 0.152: IC1.9 24.69,37.17 25.3,37.17 25.6,36.87 25.6,35.35 23.62,33.36 19.66,33.36 17.53,35.5 17.53,40.68 16.76,41.44 16.76,50.13 13.41,53.48 13.41,68.27 15.24,70.09 15.24,82.89 12.04,86.1 X2.5
D16  (via drill 0.35)
  Top 0.152: v23.16,36.57 24.54,36.57 IC1.10 | v16.61,40.22 16.61,40.68 7.16,50.13 v7.16,84.42
  Bottom 0.152: v23.16,36.57 23.01,36.57 24.12,37.9 | v16.61,40.22 17.83,39 18.29,39 18.52,40 | v7.16,84.42 7.16,86.4 11.89,91.12 X2.3
D+  (via drill 0.35)
  Top 0.152: USBC1.A6 64.01,96.15 64.47,96.15 65.08,96.76 USBC1.B6 65.23,96.92 66.29,96.92 67.06,96.15 67.06,88.53 68.89,86.7 68.89,74.51 v67.82,73.45 | v9.75,78.78 9.75,90.82 9.45,91.12 9.45,91.89 8.38,92.95 5.79,92.95 5.64,93.11 5.64,94.63 6.55,95.54 8.53,95.54 8.69,95.7 8.69,97.07 8.38,97.37 2.59,97.37 1.68,96.46 S2.1
  Bottom 0.152: v67.82,73.45 62.94,68.57 62.94,64.15 48.92,50.13 36.73,50.13 33.98,47.39 33.98,42.51 33.68,42.2 27.89,42.2 14.94,55.16 14.94,71.77 9.3,77.41 9.3,78.32 v9.75,78.78
D-  (via drill 0.35)
  Top 0.152: v65.99,96.31 65.53,95.85 65.23,95.85 USBC1.B7 | v62.94,96.46 63.25,96.46 63.4,96.61 63.86,96.61 USBC1.A7 | v9.91,77.71 9.14,78.48 9.14,91.73 8.23,92.65 5.64,92.65 5.33,92.95 5.33,94.78 6.86,96.31 7.16,96.31 S2.4
  Bottom 0.152: v65.99,96.31 65.84,96.46 v62.94,96.46 62.94,92.5 61.72,91.28 61.72,67.05 54.56,59.88 54.56,56.22 50.75,52.41 28.35,52.41 24.99,55.77 15.85,55.77 15.24,56.38 15.24,72.38 v9.91,77.71
DTR  (via drill 0.35)
  Top 0.152: v1.07,90.21 1.07,44.49 15.39,30.16 19.05,30.16 C15.2 | v3.35,97.98 9.14,97.98 12.04,100.88 X1.6
  Bottom 0.152: v1.07,90.21 1.07,95.7 v3.35,97.98
GND  (27 unrouted)
  pour Top: -5.3,128.5 77.1,128.7 77.3,-7 -2.5,-6.8 -2.7,128.5
  pour Bottom: -5.3,130.3 -5.9,-11.2 80.6,-11.2 79.8,130.6
L-OUT  (via drill 0.35)
  Top 0.152: v27.74,3.95 31.09,0.6 34.75,0.6 35.66,1.51 41,1.51 L-OUT.1 | v23.01,8.68 23.01,14.31 14.94,22.39 7.01,22.39 5.33,24.07 JP4.1
  Bottom 0.152: v23.01,8.68 v27.74,3.95
N$1
  Top 0.152: S2.6 7.32,91.28 7.32,88.38 8.84,86.86 8.84,77.87 9.6,77.1 12.34,77.1 13.11,77.87 RPI-D-.1
N$2  (via drill 0.35)
  Top 0.152: v5.79,84.88 5.79,88.99 3.5,91.28 1.68,91.28 S2.3 | v7.77,82.89 7.77,78.02 9.91,75.88 13.11,75.88 RPI-D+.1
  Bottom 0.152: v7.77,82.89 v5.79,84.88
N$11
  Top 0.152: BF998E6327HTSA1.2 60.66,60.8 60.66,60.03 46.63,46.01 46.63,45.86 45.72,44.95 42.82,44.95 42.06,44.19 42.06,38.85 38.41,35.19 34.9,35.19 33.07,37.02 27.74,37.02 23.77,33.06 19.51,33.06 17.22,35.35 17.22,40.53 12.8,44.95 12.8,68.57 13.26,69.03 13.26,71.47 GND-B.1
N$12
  Top 0.152: BF998E6327HTSA1.4 62.64,58.97 62.64,59.27 61.42,60.49 61.42,63.69 60.2,64.91 MMBT9015C.2
N$13
  Top 0.152: R4.2 56.08,73.75 56.08,72.84 55.47,72.23 55.47,69.48 58.06,66.89 60.05,66.89 MMBT9015C.1
N$14
  Top 0.152: T1.4 59.89,75.73 59.89,75.43 64.01,71.31 12K.2
N$15
  Top 0.152: 57,79.69 57,78.48 58.37,77.1 58.37,75.88 T1.6 | 57,79.69 56.69,80 55.63,80 55.32,79.69 55.32,76.34 56.08,75.58 R4.1 | 57,79.69 57.3,80 58.52,80 62.48,76.04 R1.1 62.64,75.88 65.23,73.29 65.23,71.01 66.9,69.33 66.9,65.22 C3.2
N$16
  Top 0.152: T1.2 59.13,73.9 59.13,73.75 57,71.62 56.69,71.62 R6.1
N$17
  Top 0.152: 57,74.67 57,78.02 56.08,78.93 R5.2 | 57,74.67 57,73.29 55.78,72.07 55.78,70.86 56.54,70.09 56.54,69.79 R6.2 | 57,74.67 55.47,74.67 55.17,74.36 55.17,69.33 55.93,68.57 55.93,66.44 SW3.1
N$18
  Top 0.152: T1.5 59.13,75.88 59.13,77.71 57.91,78.93 R5.1
N$19
  Top 0.152: U$3.8 48.31,39.77 48.31,42.66 48.01,42.97 R13.1
N$20
  Top 0.152: U$3.4 50.29,40.22 51.66,40.22 53.8,38.09 55.02,38.09 56.84,39.92 56.84,42.36 58.83,44.34 64.62,44.34 65.84,45.56 R15.2 65.99,45.71 67.21,46.93 67.21,49.52 65.23,51.5 65.23,52.26 C9.1
N$21
  Top 0.152: R11.2 45.72,14.31 45.72,14.77 52.43,21.48 52.43,22.24 53.03,22.85 61.27,22.85 62.33,21.78 U$1.OUT.R+
N$22  (via drill 0.35)
  Top 0.152: J1.4 26.21,1.97 26.21,3.34 27.43,4.56 28.5,4.56 31.09,1.97 33.83,1.97 J1.1 33.98,1.97 39.17,1.97 39.62,2.43 45.26,2.43 45.57,2.12 55.17,2.12 56.54,3.49 56.54,5.02 | 56.54,5.02 60.96,5.02 63.25,2.73 65.08,2.73 66.14,3.8 U$1.GND | 56.54,5.02 55.02,5.02 53.95,3.95 52.88,3.95 U$1.IN.COM 52.73,3.95 v47.55,9.13 | v45.57,11.11 45.11,11.11 42.98,13.25 41.15,13.25 GND.1
  Bottom 0.152: v47.55,9.13 v45.57,11.11
N$23
  Top 0.152: U$1.IN.L 50.29,3.95 48.01,3.95 42.67,9.29 42.67,10.81 42.52,10.96 35.2,10.96 33.98,9.74 J1.11
N$24
  Top 0.152: U$1.IN.R 55.32,3.8 54.41,3.8 53.03,2.43 45.72,2.43 44.96,3.19 30.33,3.19 27.74,5.78 20.57,5.78 20.27,6.09 20.27,7.46 20.88,8.07 23.32,8.07 26.06,10.81 J1.10
N$25
  Top 0.152: J1.2 26.21,8.22 28.19,8.22 32.92,3.49 37.03,3.49 41,7.46 R-IN.1
N$26
  Top 0.152: J1.3 33.98,4.71 35.66,4.71 41,10.05 L-IN.1
N$27
  Top 0.152: R10.2 45.72,8.37 46.18,8.83 46.33,8.83 53.49,15.99 53.49,21.63 U$1.OUT.L+
N$28
  Top 0.152: R11.1 45.72,12.49 46.18,12.03 46.18,10.81 45.72,10.35 45.72,10.05 R10.1 45.57,10.05 43.89,10.05 42.67,11.27 28.8,11.27 27.13,9.59 25.3,9.59 22.55,6.85 21.95,6.85 SPK+.1
N$29  (via drill 0.35)
  Top 0.152: v37.64,15.38 45.41,23.15 62.48,23.15 63.86,21.78 64.92,21.78 U$1.OUT.R- | v27.43,5.17 23.16,5.17 21.95,3.95 SPK-.1
  Bottom 0.152: v27.43,5.17 v37.64,15.38
N$30
  Top 0.152: R2.2 66.14,77.26 66.14,83.35 61.42,88.08 IC2.6
N$31
  Top 0.152: R3.2 66.14,86.4 64.47,86.4 61.42,89.45 IC2.7
N$32
  Top 0.152: LEDG1.C 68.12,79.24 68.12,77.41 67.97,77.26 R2.1
N$33
  Top 0.152: U$3.2 49.38,39 47.85,39 47.7,38.85 47.7,33.36 49.38,31.69 L2.2
N$34
  Top 0.152: LEDR1.C 67.97,83.81 67.97,86.25 R3.1
N$35  (via drill 0.35)
  Top 0.152: 53.03,40.98 53.95,40.98 54.25,40.68 R17.1 54.41,40.53 54.41,39 R16.2 | 53.03,40.98 49.53,40.98 49.23,40.68 49.23,40.38 U$3.6 | v53.03,39.77 53.03,40.98 | v46.18,37.63 44.65,39.16 C7.2
  Bottom 0.152: v53.03,39.77 50.9,37.63 v46.18,37.63
N$36
  Top 0.152: R8.2 60.2,85.33 58.67,85.33 56.84,87.16 56.84,88.53 55.93,89.45 IC2.2
N$37
  Top 0.152: U1.3 60.96,42.05 62.03,42.05 62.79,42.81 65.68,42.81 66.45,42.05 U3.3
N$38
  Top 0.152: U1.1 60.96,40.07 61.27,40.07 62.79,41.59 62.79,42.36 62.94,42.51 64.47,42.51 65.53,41.44 65.53,40.68 66.14,40.07 66.45,40.07 U3.1
N$39
  Top 0.152: R12.2 60.81,37.17 62.03,35.96 65.84,35.96 67.36,37.48 67.36,40.53 66.9,40.98 66.6,40.98 U3.2
N$40  (via drill 0.35)
  Top 0.152: 62.33,69.64 60.66,69.64 60.5,69.79 23K.2 | 62.33,69.64 64.01,69.64 12K.1 | v62.33,66.74 62.33,69.64 | v59.59,64 58.22,64 56.08,61.86 RESET.1
  Bottom 0.152: v59.59,64 v62.33,66.74
N$41
  Top 0.152: R7.1 21.79,42.2 24.54,42.2 IC1.3
N$42
  Top 0.152: R18.1 21.79,39.16 23.93,41.29 24.54,41.29 IC1.4
N$43
  Top 0.152: C12.1 24.54,27.57 28.35,27.57 X3.P$1 28.5,27.73 29.57,28.79 29.57,33.82 IC1.16
N$44
  Top 0.152: C11.1 36.42,27.57 32.61,27.57 X3.P$2 32.46,27.73 30.48,29.71 30.48,33.82 IC1.17
N$45
  Bottom 0.152: R19.2 62.94,104.38 64.77,104.38 PWR.A
R-OUT
  Top 0.152: R-OUT.1 41.15,4.26 47.24,4.26 48.77,2.73 50.75,2.73 51.51,3.49 51.51,4.26 48.31,7.46 44.96,7.46 44.81,7.61 44.81,8.98 44.96,9.13 46.18,9.13 46.48,9.44 46.48,13.1 46.18,13.4 43.28,13.4 41.91,14.77 23.01,14.77 13.72,24.07 7.92,24.07 JP4.2
RESET  (via drill 0.35)
  Top 0.152: v24.54,31.54 23.16,30.16 21.34,30.16 C15.1 | IC1.13 27.13,33.82 27.13,33.21 26.67,32.76 v25.76,32.76 19.36,32.76 5.94,46.17 v5.94,77.56
  Bottom 0.152: v25.76,32.76 v24.54,31.54 | v5.94,77.56 11.89,83.5 X2.6
VBUS
  Top 0.152: USBC1.B9 65.08,94.94 64.62,94.94 64.47,95.09 64.01,95.09 USBC1.A4 63.86,95.09 63.4,95.09 | USBC1.B4 65.08,97.83 64.62,97.83 64.47,97.68 64.01,97.68 USBC1.A9 63.86,97.53 63.09,97.53 62.33,96.76 62.33,96.15 63.4,95.09 | C1.1 55.63,84.72 55.63,86.55 55.78,86.7 IC2.4 55.78,86.86 55.17,87.47 55.02,87.47 54.86,87.62 54.86,89.75 55.02,89.91 56.54,89.91 57.3,90.67 61.27,90.67 IC2.8 61.42,90.52 62.94,90.52 | LEDG1.A 68.12,80.91 68.12,82.13 LEDR1.A 67.97,82.29 67.97,82.59 67.06,83.5 67.06,86.86 63.4,90.52 62.94,90.52 | 63.4,95.09 62.94,94.63 62.94,90.52
VCC  (via drill 0.35)
  Top 0.152: IC1.44 26.52,45.56 26.52,46.32 27.58,47.39 31.24,47.39 31.85,48 31.85,48.3 SJ2.1 32,48.45 34.29,46.17 34.29,45.56 IC1.34 34.29,45.41 34.29,44.8 32.77,43.27 32.77,39.31 34.29,37.78 | 34.29,37.78 35.51,36.57 36.12,36.57 IC1.24 36.27,36.57 37.64,36.57 39.17,38.09 39.17,45.25 45.11,51.2 45.72,51.2 C13.1 45.87,51.35 49.68,51.35 C14.1 49.84,51.35 54.41,55.92 54.41,79.24 56.08,80.91 62.18,80.91 R9.1 | U3.5 63.7,40.98 64.01,40.98 65.53,39.46 65.53,37.17 C2.2 65.53,37.02 64.77,36.26 62.33,36.26 62.03,36.57 62.03,37.33 60.5,38.85 58.67,38.85 53.34,33.52 53.34,31.69 50.9,29.25 46.02,29.25 44.65,30.62 39.01,30.62 32.92,36.72 | 32.92,36.72 30.18,36.72 28.04,34.58 28.04,33.97 IC1.14 27.89,33.82 27.89,33.21 26.82,32.15 19.51,32.15 14.02,37.63 10.06,37.63 3.81,43.88 3.81,44.49 3.96,44.64 v3.96,89.91 | 34.29,37.78 33.83,37.33 v33.83,37.17 | 32.92,36.72 v32.92,36.26
  Bottom 0.152: v3.96,89.91 3.96,100.57 10.67,107.28 10.82,107.28 12.04,108.5 X1.3 | v32.92,36.26 v33.83,37.17